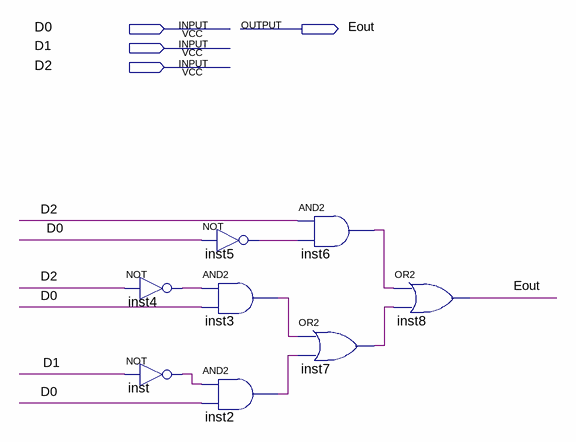
[diagram p0: schematic sheet]
// Quartus schematic E-Logic.bdf as structural Verilog: 8 symbols, 4 pins
module \E-Logic  (
  input  D0,
  input  D1,
  input  D2,
  output Eout
);

  wire inst2_out, inst3_out, inst4_out, inst5_out, inst6_out, inst7_out, inst_out;

  not inst4 (inst4_out, D2);
  not inst (inst_out, D1);
  not inst5 (inst5_out, D0);
  and inst3 (inst3_out, inst4_out, D0);
  and inst2 (inst2_out, inst_out, D0);
  and inst6 (inst6_out, D2, inst5_out);
  or inst7 (inst7_out, inst3_out, inst2_out);
  or inst8 (Eout, inst6_out, inst7_out);
endmodule
